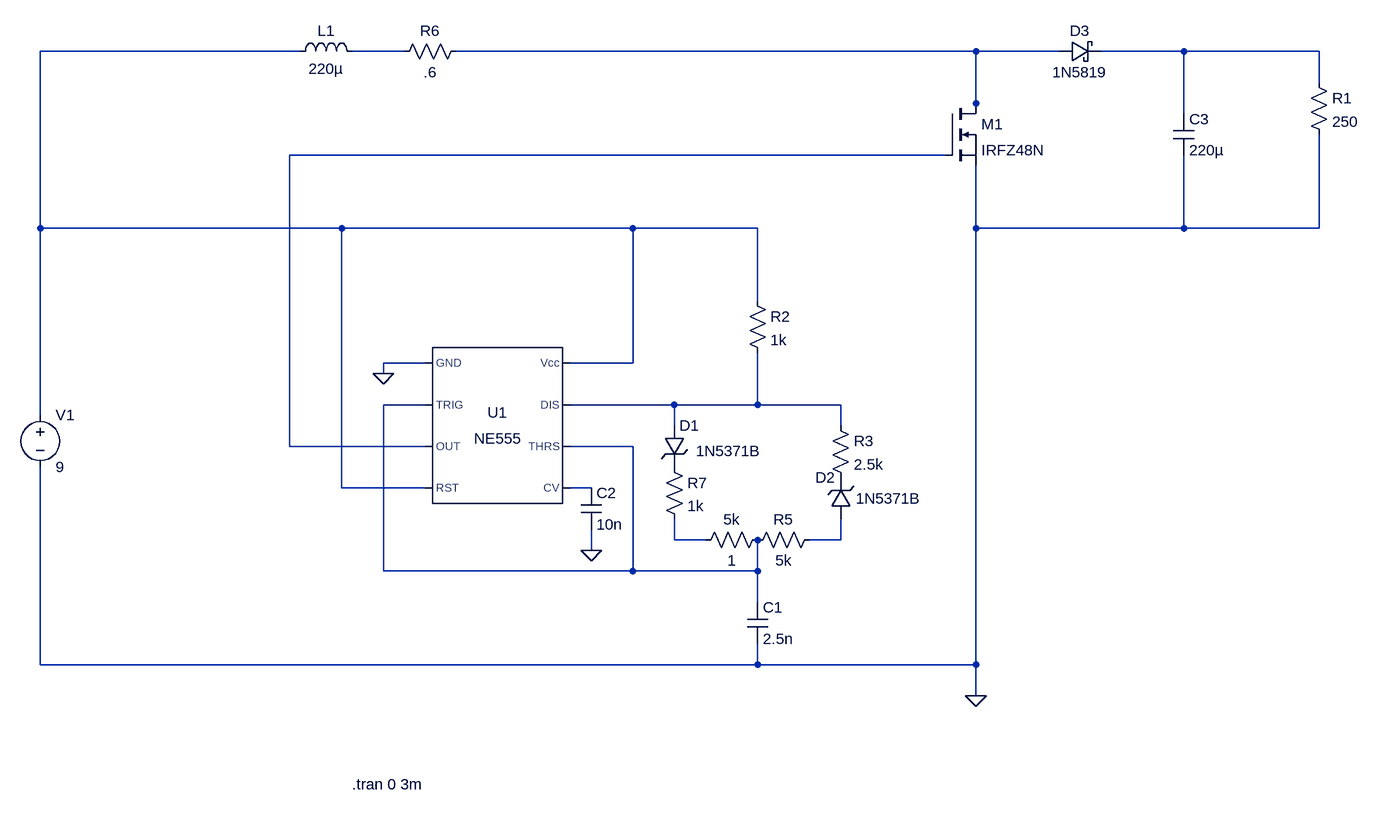
[diagram p0: schematic schematic.asc]
schematic.asc, the LTspice schematic file:
Version 4
SHEET 1 1724 760
WIRE -80 -384 -480 -384
WIRE 80 -384 0 -384
WIRE 960 -384 160 -384
WIRE 1088 -384 960 -384
WIRE 1280 -384 1152 -384
WIRE 1488 -384 1280 -384
WIRE 1488 -336 1488 -384
WIRE 960 -304 960 -384
WIRE 960 -288 960 -304
WIRE 1280 -288 1280 -384
WIRE 912 -224 -96 -224
WIRE -480 -112 -480 -384
WIRE -16 -112 -480 -112
WIRE 432 -112 -16 -112
WIRE 624 -112 432 -112
WIRE 960 -112 960 -208
WIRE 1280 -112 1280 -224
WIRE 1280 -112 960 -112
WIRE 1488 -112 1488 -256
WIRE 1488 -112 1280 -112
WIRE 624 0 624 -112
WIRE 112 96 48 96
WIRE 432 96 432 -112
WIRE 432 96 336 96
WIRE 48 112 48 96
WIRE 112 160 48 160
WIRE 496 160 336 160
WIRE 624 160 624 80
WIRE 624 160 496 160
WIRE 752 160 624 160
WIRE -480 176 -480 -112
WIRE 496 192 496 160
WIRE 752 192 752 160
WIRE -96 224 -96 -224
WIRE 112 224 -96 224
WIRE 432 224 336 224
WIRE -16 288 -16 -112
WIRE 112 288 -16 288
WIRE 368 288 336 288
WIRE 496 368 496 336
WIRE 544 368 496 368
WIRE 752 368 752 336
WIRE 752 368 704 368
WIRE 368 384 368 352
WIRE 48 416 48 160
WIRE 432 416 432 224
WIRE 432 416 48 416
WIRE 624 416 624 368
WIRE 624 416 432 416
WIRE 624 464 624 416
WIRE -480 560 -480 256
WIRE 624 560 624 528
WIRE 624 560 -480 560
WIRE 960 560 960 -112
WIRE 960 560 624 560
WIRE 960 608 960 560
FLAG 48 112 0
FLAG 368 384 0
FLAG 960 608 0
SYMBOL Misc\\NE555 224 192 R0
SYMATTR InstName U1
SYMBOL res 608 -16 R0
SYMATTR InstName R2
SYMATTR Value 1k
SYMBOL zener 480 192 R0
WINDOW 3 49 39 Left 2
SYMATTR Value 1N5371B
SYMATTR InstName D1
SYMATTR Description Diode
SYMATTR Type diode
SYMBOL zener 768 336 R180
WINDOW 0 24 64 Left 2
WINDOW 3 -108 32 Left 2
SYMATTR InstName D2
SYMATTR Value 1N5371B
SYMATTR Description Diode
SYMATTR Type diode
SYMBOL res 736 176 R0
SYMATTR InstName R3
SYMATTR Value 2.5k
SYMBOL cap 608 464 R0
SYMATTR InstName C1
SYMATTR Value 2.5n
SYMBOL cap 352 288 R0
SYMATTR InstName C2
SYMATTR Value 10n
SYMBOL res 640 352 R90
WINDOW 0 0 56 VBottom 2
WINDOW 3 32 56 VTop 2
SYMATTR InstName 5k
SYMATTR Value 1
SYMBOL res 720 352 R90
WINDOW 0 0 56 VBottom 2
WINDOW 3 32 56 VTop 2
SYMATTR InstName R5
SYMATTR Value 5k
SYMBOL voltage -480 160 R0
WINDOW 123 0 0 Left 2
WINDOW 39 0 0 Left 2
SYMATTR InstName V1
SYMATTR Value 9
SYMBOL ind -96 -368 R270
WINDOW 0 32 56 VTop 2
WINDOW 3 5 56 VBottom 2
SYMATTR InstName L1
SYMATTR Value 220µ
SYMBOL res 64 -368 R270
WINDOW 0 32 56 VTop 2
WINDOW 3 0 56 VBottom 2
SYMATTR InstName R6
SYMATTR Value .6
SYMBOL nmos 912 -304 R0
SYMATTR InstName M1
SYMATTR Value IRFZ48N
SYMBOL schottky 1088 -368 R270
WINDOW 0 32 32 VTop 2
WINDOW 3 0 32 VBottom 2
SYMATTR InstName D3
SYMATTR Value 1N5819
SYMATTR Description Diode
SYMATTR Type diode
SYMBOL cap 1264 -288 R0
SYMATTR InstName C3
SYMATTR Value 220µ
SYMBOL res 1472 -352 R0
SYMATTR InstName R1
SYMATTR Value 250
SYMBOL res 480 240 R0
SYMATTR InstName R7
SYMATTR Value 1k
TEXT 0 744 Left 2 !.tran 0 3m

The netlist it stands for:
* schematic.asc
XU1 0 N006 N005 N001 N008 N006 N007 N001 NE555  ; pins GND TRIG OUT RST CV THRS DIS Vcc
R2 N001 N007 1k
D1 N007 P001 1N5371B
D2 N010 P002 1N5371B
R3 N007 P002 2.5k
C1 N006 0 2.5n
C2 N008 0 10n
R§5k N006 N009 1
R5 N010 N006 5k
V1 N001 0 9
L1 N001 N002 220µ
R6 N002 N003 .6
M1 N003 N005 0 0 IRFZ48N
D3 N003 N004 1N5819
C3 N004 0 220µ
R1 N004 0 250
R7 P001 N009 1k
.model D D
.lib standard.dio
.model NMOS NMOS
.model PMOS PMOS
.lib standard.mos
.tran 0 3m
.lib NE555.sub
.backanno
.end